# EAGLE design ball_presence_led (EAGLE 9.6.2)
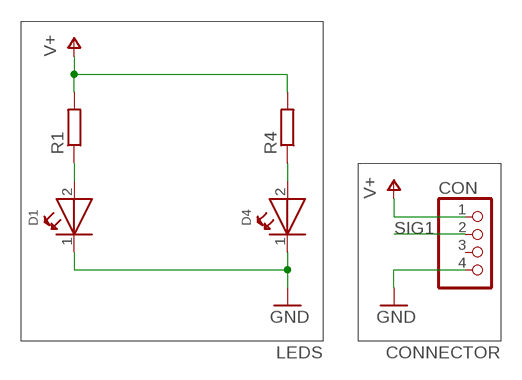
[diagram p0: schematic, sheet 1]

## Parts
CON  PINHD-1X4  [1X04]
D1  WL-SMTW-150141AS73100-A  [3528-2PIN]
D4  WL-SMTW-150141AS73100-A  [3528-2PIN]
R1  R-EU_R0805  [R0805]
R4  R-EU_R0805  [R0805]

## Nets
GND: CON.4 D1.1(K) D4.1(K)
N$1: D1.2(A) R1.1
N$4: D4.2(A) R4.1
SIG1: CON.2
V+: CON.1 R1.2 R4.2
Unconnected: CON.3

## Notes on the sheet
- LEDS | CONNECTOR

## Library data of the parts
CON = pinhead:PINHD-1X4: PIN HEADER
D1 D4 = Wurth_Elektronik_Optoelectronics_rev15b:WL-SMTW: SMD Side view mono-color round Characteristics Low power consumption High reliability Low current requirement No UV/IR radiation Wide viewing angle Excelllent for edge lighting displays and backlighting indicators Ideal for miniature applications PBC high-usage Compatible with automatic placement equipment Applications Backlighting for LCD Sidelighting applications Indicator and backlighting for telecommunication Backlighting for symbol, switch and dashboard General use <http://katalog.we-online.de/media/images/eipal/WL-SMTW_pf2.jpg> Details see: http://katalog.we-online.de/en/led/WL-SMTW?m Updated: 2015-04-10 2015 (C) Wurth Elektronik; COMPANY-URL: http://www.we-online.de; CREATED-BY: Christin Otto; CREATED-DATE: APR 2013; DATASHEET-URL: http://katalog.we-online.de/en/led/WL-SMTW?m=t&sq=smtw&sp=&sp=http%3A%2F%2Fwww.we-online.de%2Fweb%2Fen%2Felectronic_components%2Fsearchpage_PBS.php%3Fsearch%3Dsmtw; MANUFACTURER: Würth Elektronik eiSos GmbH
R1 R4 = rcl:R-EU_: RESISTOR, European symbol; SPICEPREFIX: R

## Board
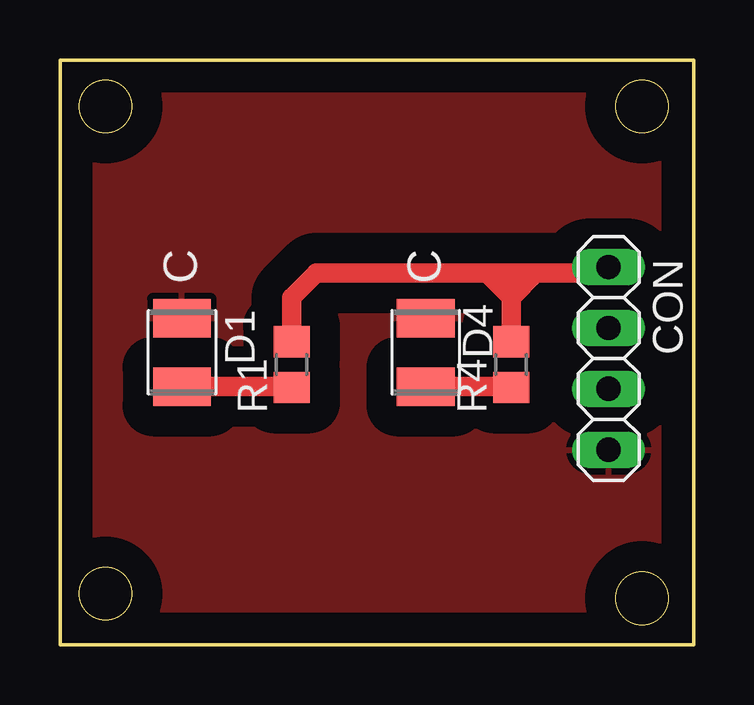
[diagram p1: board, top side]

Size 26.42 x 24.38 mm. Coordinates in mm from the lower left corner, seen from the top.
Outline: 0,0 0,24.38 26.42,24.38 26.42,0 0,0
Outline: circle at 24.25,22.45 radius 1.1
Outline: circle at 24.25,1.94 radius 1.1
Outline: circle at 1.89,22.45 radius 1.1
Outline: circle at 1.89,2.13 radius 1.1
Copper layers (1*16): Top 0.035mm / dielectric 1.5mm / Bottom 0.035mm
Design rules "default": minimum track width 6mil, minimum drill 0.35mm, track to track 6mil, track to pad 6mil, pad to pad 6mil, via to via 6mil, smd to smd 6mil, copper to edge 40mil, drill to drill 6mil, minimum pad ring 10mil, minimum via ring 8mil, stop-mask expansion 4mil, vias tented up to drill 0mil, thermal gap 10mil

### Footprints (pad centres in the part's own frame; a part is rotated, then mirrored left to right if it is on the bottom)
1X04 = drill 1.016 long: 1 -3.81,0; 2 -1.27,0; 3 1.27,0; 4 3.81,0
3528-2PIN = smd 1.6 x 2.4: 1 -1.425,0; 2 1.425,0
R0805 = smd 1.3 x 1.5: 1 -0.95,0; 2 0.95,0

### Placement (x,y rotation side)
CON  22.86,11.94 270 top
D1  5.08,12.19 270 top
D4  15.24,12.19 270 top
R1  9.65,11.68 90 top
R4  18.8,11.68 90 top

### Tracks (layer width: path | path; a pad name or v marks a point on that pad's centre or on a via)
GND
  pour Top (isolate 1.27): -0.25,24.64 -0.25,-0.76 26.67,-0.76 26.67,24.64
N$1
  Top 0.813: 9.59,10.67 R1.1 9.62,10.77 D1.2
N$4
  Top 0.813: D4.2 18.76,10.77 R4.1
V+
  Top 0.813: 19.05,12.63 R4.2 18.8,14.48 | CON.1 22.61,15.49 19.81,15.49 | R1.2 9.65,14.48 10.67,15.49 17.78,15.49 | 19.81,15.49 18.8,15.49 | 18.8,15.49 17.78,15.49 | 18.8,14.48 18.8,14.99 18.8,15.49 | 18.8,14.48 19.81,15.49 | 17.78,15.49 18.8,14.48